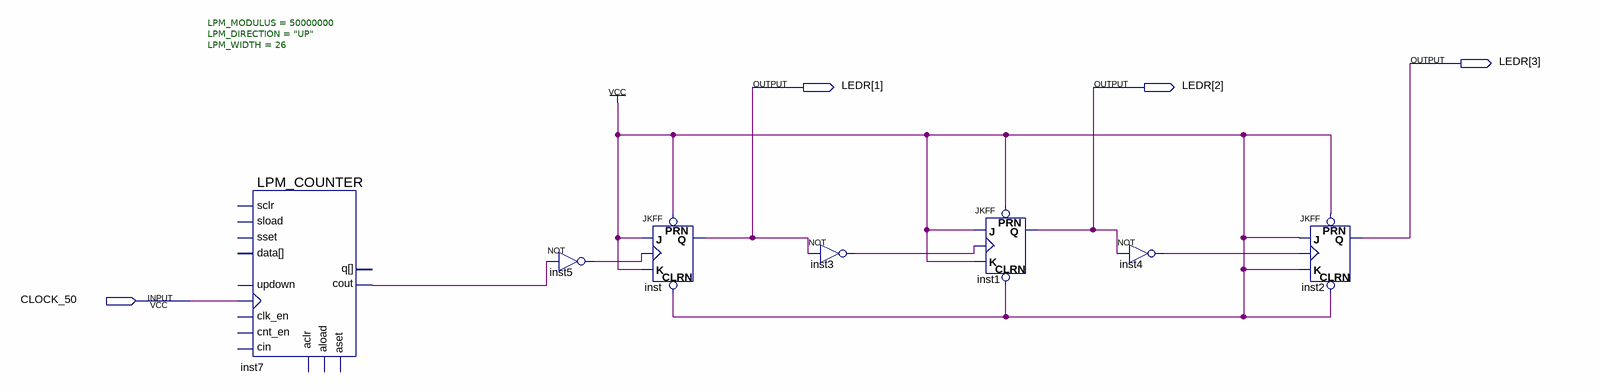
[diagram p0: schematic sheet]
// Quartus schematic pulseCouter.bdf as structural Verilog: 7 symbols, 4 pins
module pulseCouter (
  input  CLOCK_50,
  output [3:1] LEDR
);

  wire inst3_out, inst4_out, inst5_out, inst7_cout;

  LPM_COUNTER #(.LPM_MODULUS(50000000), .LPM_DIRECTION("UP"), .LPM_WIDTH(26)) inst7 (
    .clock(CLOCK_50), .cout(inst7_cout));  // open: sload, data, clk_en, aload, aclr, aset, cin, sset, updown, cnt_en, sclr, q
  not inst5 (inst5_out, inst7_cout);
  JKFF inst (.PRN(1'b1), .CLRN(1'b1), .K(1'b1), .J(1'b1), .CLK(inst5_out), .Q(LEDR[1]));
  not inst3 (inst3_out, LEDR[1]);
  JKFF inst1 (.PRN(1'b1), .CLRN(1'b1), .K(1'b1), .J(1'b1), .CLK(inst3_out), .Q(LEDR[2]));
  not inst4 (inst4_out, LEDR[2]);
  JKFF inst2 (.PRN(1'b1), .CLRN(1'b1), .K(1'b1), .J(1'b1), .CLK(inst4_out), .Q(LEDR[3]));
endmodule
